# EAGLE schematic mainboard_rev_a (EAGLE 6.2)

## Sheet 1 of 4: MCU
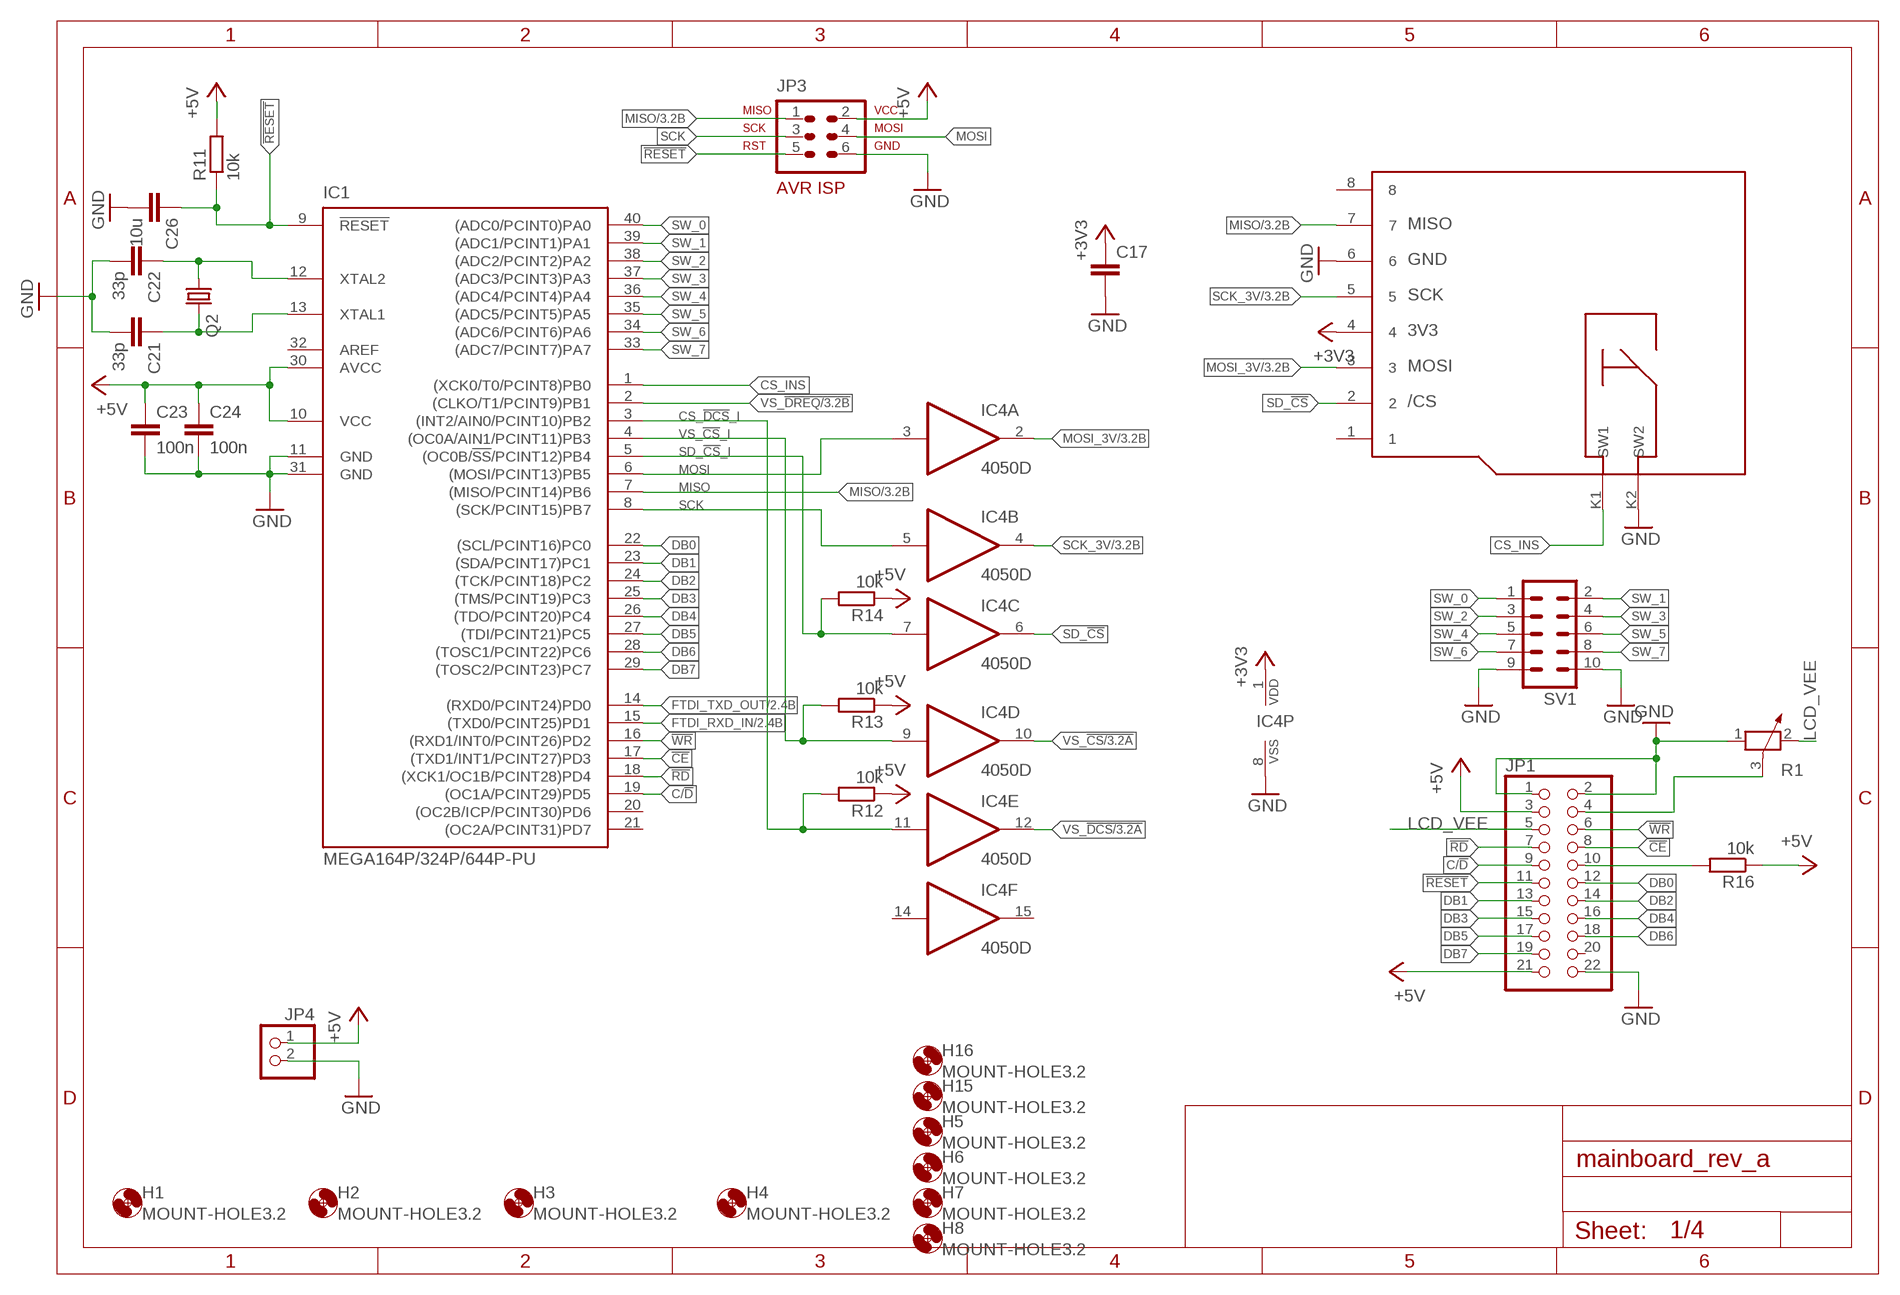
[diagram p0: schematic, sheet 1]

### Parts
C17  C-EUC1206  [C1206]
C21  33p  C-EUC0603  [C0603]
C22  33p  C-EUC0603  [C0603]
C23  100n  C-EUC0603  [C0603]
C24  100n  C-EUC0603  [C0603]
C26  10u  C-EUC1206  [C1206]
H1  MOUNT-HOLE3.2  [3,2]
H2  MOUNT-HOLE3.2  [3,2]
H3  MOUNT-HOLE3.2  [3,2]
H4  MOUNT-HOLE3.2  [3,2]
H5  MOUNT-HOLE3.2  [3,2]
H6  MOUNT-HOLE3.2  [3,2]
H7  MOUNT-HOLE3.2  [3,2]
H8  MOUNT-HOLE3.2  [3,2]
H15  MOUNT-HOLE3.2  [3,2]
H16  MOUNT-HOLE3.2  [3,2]
IC1  MEGA164P/324P/644P-PU  [DIL40]
IC4  4050D  [SO16]
JP1  PINHD-2X11  [2X11]
JP3  AVR-ISP-6VERT  [AVR-ISP-6]
JP4  PINHD-1X2  [1X02]
Q2  CRYSTALHC49UP  [HC49UP]
R1  POTENTIOMETER_PT_SPIN  [PT-SPIN]
R11  10k  R-EU_R0603  [R0603]
R12  10k  R-EU_R0603  [R0603]
R13  10k  R-EU_R0603  [R0603]
R14  10k  R-EU_R0603  [R0603]
R16  10k  R-EU_R0603  [R0603]
SV1  ML10  [ML10]
X2  MICRO-SD  [MICRO-SD]

### Nets
!CE: IC1.17((TXD1/INT1/PCINT27)PD3) JP1.8
!HALT: JP1.10 R16.2
!RD: IC1.18((XCK1/OC1B/PCINT28)PD4) JP1.7
!RESET: C26.1 IC1.9(!RESET) JP1.11 JP3.5 R11.1
!WR: IC1.16((RXD1/INT0/PCINT26)PD2) JP1.6
+3V3: C17.1 IC4.1(P:VDD) X2.4 ; also sheet 2,3
+5V: C23.1 C24.1 IC1.10(VCC) IC1.30(AVCC) JP1.3 JP1.21 JP3.2 JP4.1 R11.2 R12.1 R13.1 R14.1 R16.1 ; also sheet 2
C/!D: IC1.19((OC1A/PCINT29)PD5) JP1.9
CS_!DCS!_I: IC1.3((INT2/AIN0/PCINT10)PB2) IC4.11(E:I) R12.2
CS_INS: IC1.1((XCK0/T0/PCINT8)PB0) X2.K1(SW1)
DB0: IC1.22((SCL/PCINT16)PC0) JP1.12
DB1: IC1.23((SDA/PCINT17)PC1) JP1.13
DB2: IC1.24((TCK/PCINT18)PC2) JP1.14
DB3: IC1.25((TMS/PCINT19)PC3) JP1.15
DB4: IC1.26((TDO/PCINT20)PC4) JP1.16
DB5: IC1.27((TDI/PCINT21)PC5) JP1.17
DB6: IC1.28((TOSC1/PCINT22)PC6) JP1.18
DB7: IC1.29((TOSC2/PCINT23)PC7) JP1.19
FTDI_RXD_IN: IC1.15((TXD0/PCINT25)PD1) ; also sheet 2
FTDI_TXD_OUT: IC1.14((RXD0/PCINT24)PD0) ; also sheet 2
GND: C17.2 C21.2 C22.2 C23.2 C24.2 C26.2 IC1.11(GND) IC1.31(GND) IC4.8(P:VSS) JP1.1 JP1.2 JP1.22 JP3.6 JP4.2 R1.1 SV1.9 SV1.10 X2.6 X2.K2(SW2) ; also sheet 2,3,4
LCD_VEE: JP1.5 R1.2
MISO: IC1.7((MISO/PCINT14)PB6) JP3.1 X2.7 ; also sheet 3
MOSI: IC1.6((MOSI/PCINT13)PB5) IC4.3(A:I) JP3.4
MOSI_3V: IC4.2(A:O) X2.3 ; also sheet 3
N$1: JP1.4 R1.3
N$21: C21.1 IC1.13(XTAL1) Q2.2
N$22: C22.1 IC1.12(XTAL2) Q2.1
SCK: IC1.8((SCK/PCINT15)PB7) IC4.5(B:I) JP3.3
SCK_3V: IC4.4(B:O) X2.5 ; also sheet 3
SD_!CS: IC4.6(C:O) X2.2
SD_!CS!_I: IC1.5((OC0B/!SS!/PCINT12)PB4) IC4.7(C:I) R14.2
SW_0: IC1.40((ADC0/PCINT0)PA0) SV1.1
SW_1: IC1.39((ADC1/PCINT1)PA1) SV1.2
SW_2: IC1.38((ADC2/PCINT2)PA2) SV1.3
SW_3: IC1.37((ADC3/PCINT3)PA3) SV1.4
SW_4: IC1.36((ADC4/PCINT4)PA4) SV1.5
SW_5: IC1.35((ADC5/PCINT5)PA5) SV1.6
SW_6: IC1.34((ADC6/PCINT6)PA6) SV1.7
SW_7: IC1.33((ADC7/PCINT7)PA7) SV1.8
VS_!CS: IC4.10(D:O) ; also sheet 3
VS_!CS!_I: IC1.4((OC0A/AIN1/PCINT11)PB3) IC4.9(D:I) R13.2
VS_!DCS: IC4.12(E:O) ; also sheet 3
VS_!DREQ: IC1.2((CLKO/T1/PCINT9)PB1) ; also sheet 3
Unconnected: IC1.20((OC2B/ICP/PCINT30)PD6) IC1.21((OC2A/PCINT31)PD7) IC4.14(F:I) IC4.15(F:O) JP1.20 X2.1 X2.8

## Sheet 2 of 4: USB
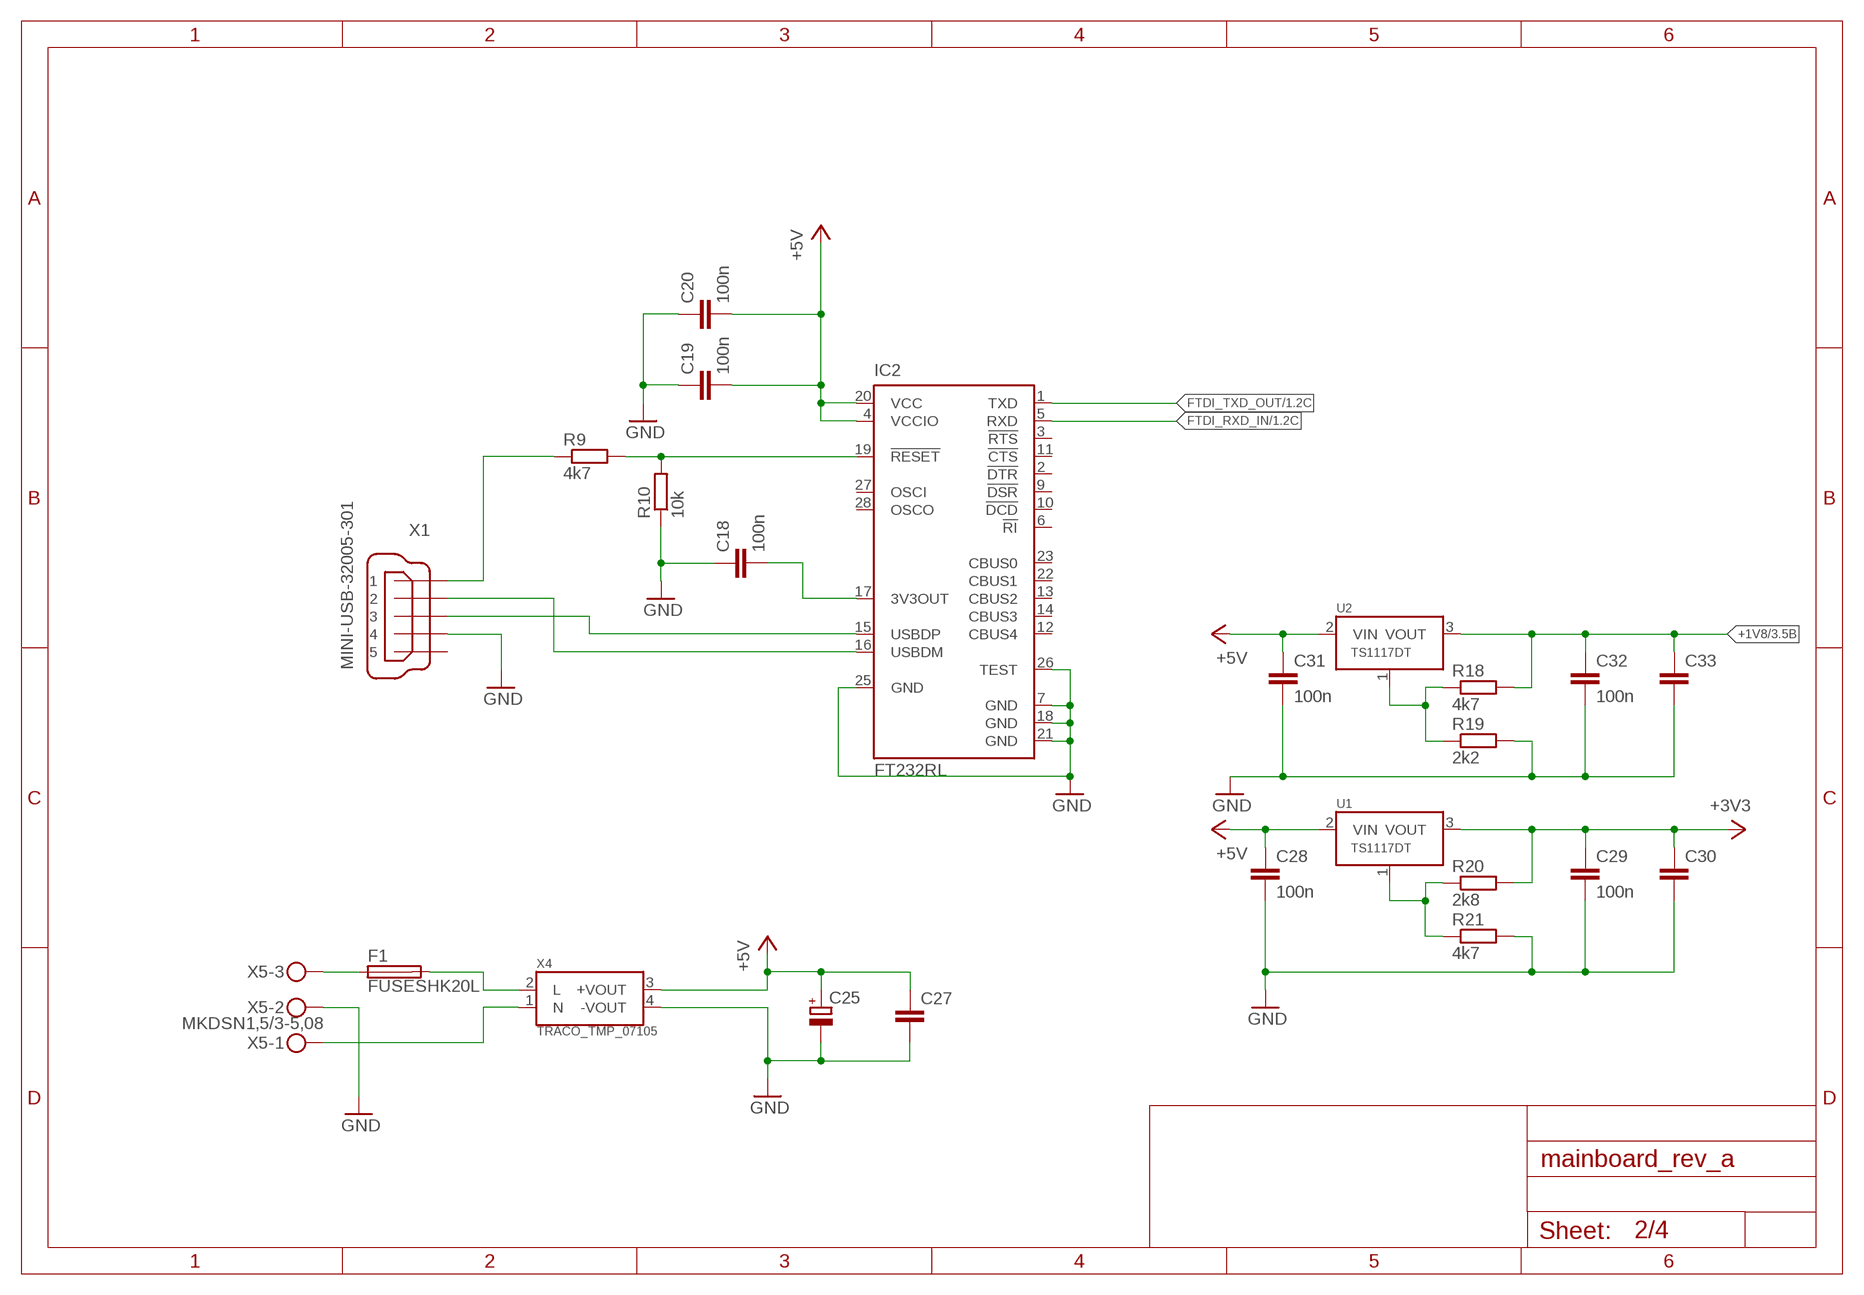
[diagram p1: schematic, sheet 2]

### Parts
C18  100n  C-EUC0603  [C0603]
C19  100n  C-EUC0603  [C0603]
C20  100n  C-EUC0603  [C0603]
C25  CPOL-EU153CLV-0807  [153CLV-0807]
C27  C-EUC1206  [C1206]
C28  100n  C-EUC0603  [C0603]
C29  100n  C-EUC0603  [C0603]
C30  C-EUC1206  [C1206]
C31  100n  C-EUC0603  [C0603]
C32  100n  C-EUC0603  [C0603]
C33  C-EUC1206  [C1206]
F1  FUSESHK20L  [SHK20L]
IC2  FT232RL  [SSOP28]
R9  4k7  R-EU_R0603  [R0603]
R10  10k  R-EU_R0603  [R0603]
R18  4k7  R-EU_R0603  [R0603]
R19  2k2  R-EU_R0603  [R0603]
R20  2k8  R-EU_R0603  [R0603]
R21  4k7  R-EU_R0603  [R0603]
U1  TS1117DT  [TO252]
U2  TS1117DT  [TO252]
X1  MINI-USB-32005-301  [32005-301]
X4  TRACO_TMP_07105  [TRACO_TMP_07]
X5  MKDSN1,5/3-5,08  [MKDSN1,5/3-5,08]

### Nets
+1V8: C32.1 C33.1 R18.2 U2.3(VOUT) ; also sheet 3
+3V3: C29.1 C30.1 R20.2 U1.3(VOUT) ; also sheet 1,3
+5V: C19.2 C20.2 C25.+ C27.1 C28.1 C31.1 IC2.4(VCCIO) IC2.20(VCC) U1.2(VIN) U2.2(VIN) X4.3(+VOUT) ; also sheet 1
FTDI_RXD_IN: IC2.5(RXD) ; also sheet 1
FTDI_TXD_OUT: IC2.1(TXD) ; also sheet 1
GND: C18.1 C19.1 C20.1 C25.- C27.2 C28.2 C29.2 C30.2 C31.2 C32.2 C33.2 IC2.7(GND) IC2.18(GND) IC2.21(GND) IC2.25(GND) IC2.26(TEST) R10.1 R19.2 R21.2 X1.4 X4.4(-VOUT) X5.2 ; also sheet 1,3,4
N$5: F1.1A X5.3
N$12: F1.2A X4.2(L)
N$16: C18.2 IC2.17(3V3OUT)
N$17: IC2.16(USBDM) X1.2
N$18: IC2.15(USBDP) X1.3
N$19: R9.1 X1.1
N$20: IC2.19(!RESET) R9.2 R10.2
N$23: X4.1(N) X5.1
N$25: R20.1 R21.1 U1.1(ADJ)
N$26: R18.1 R19.1 U2.1(ADJ)
Unconnected: IC2.2(!DTR) IC2.3(!RTS) IC2.6(!RI) IC2.9(!DSR) IC2.10(!DCD) IC2.11(!CTS) IC2.12(CBUS4) IC2.13(CBUS2) IC2.14(CBUS3) IC2.22(CBUS1) IC2.23(CBUS0) IC2.27(OSCI) IC2.28(OSCO) X1.5

## Sheet 3 of 4: MP3
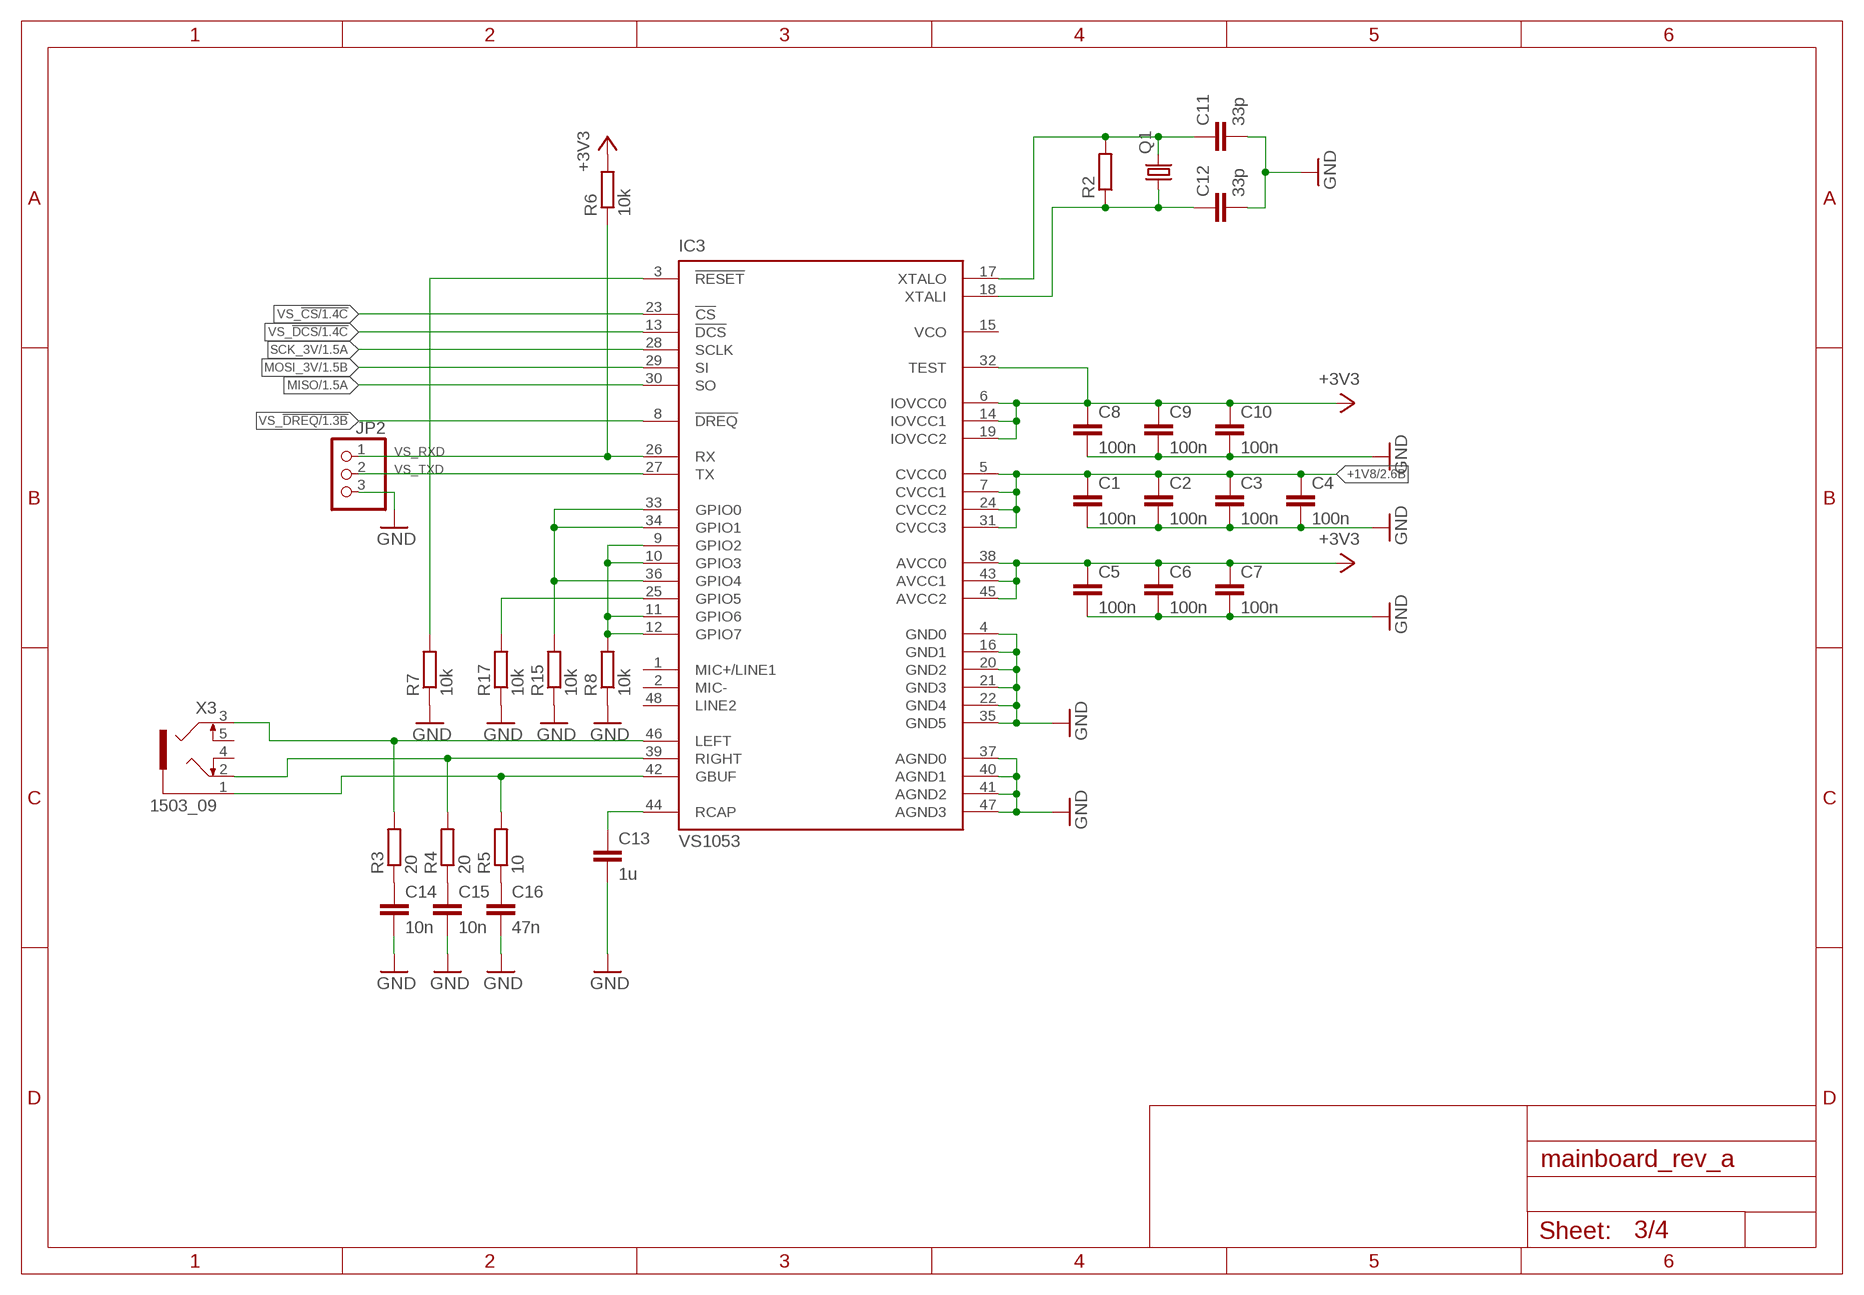
[diagram p2: schematic, sheet 3]

### Parts
C1  100n  C-EUC0603  [C0603]
C2  100n  C-EUC0603  [C0603]
C3  100n  C-EUC0603  [C0603]
C4  100n  C-EUC0603  [C0603]
C5  100n  C-EUC0603  [C0603]
C6  100n  C-EUC0603  [C0603]
C7  100n  C-EUC0603  [C0603]
C8  100n  C-EUC0603  [C0603]
C9  100n  C-EUC0603  [C0603]
C10  100n  C-EUC0603  [C0603]
C11  33p  C-EUC0603  [C0603]
C12  33p  C-EUC0603  [C0603]
C13  1u  C-EUC0805  [C0805]
C14  10n  C-EUC0603  [C0603]
C15  10n  C-EUC0603  [C0603]
C16  47n  C-EUC0603  [C0603]
IC3  VS1053  [LQFP-48]
JP2  PINHD-1X3  [1X03]
Q1  CRYSTALHC49UP  [HC49UP]
R2  R-EU_R0603  [R0603]
R3  20  R-EU_R0603  [R0603]
R4  20  R-EU_R0603  [R0603]
R5  10  R-EU_R0603  [R0603]
R6  10k  R-EU_R0603  [R0603]
R7  10k  R-EU_R0603  [R0603]
R8  10k  R-EU_R0603  [R0603]
R15  10k  R-EU_R0603  [R0603]
R17  10k  R-EU_R0603  [R0603]
X3  1503_09  [1503_09]

### Nets
+1V8: C1.1 C2.1 C3.1 C4.1 IC3.5(CVCC0) IC3.7(CVCC1) IC3.24(CVCC2) IC3.31(CVCC3) ; also sheet 2
+3V3: C5.1 C6.1 C7.1 C8.1 C9.1 C10.1 IC3.6(IOVCC0) IC3.14(IOVCC1) IC3.19(IOVCC2) IC3.32(TEST) IC3.38(AVCC0) IC3.43(AVCC1) IC3.45(AVCC2) R6.2 ; also sheet 1,2
GBUF: IC3.42(GBUF) R5.2 X3.1
GND: C1.2 C2.2 C3.2 C4.2 C5.2 C6.2 C7.2 C8.2 C9.2 C10.2 C11.2 C12.2 C13.2 C14.2 C15.2 C16.2 IC3.4(GND0) IC3.16(GND1) IC3.20(GND2) IC3.21(GND3) IC3.22(GND4) IC3.35(GND5) IC3.37(AGND0) IC3.40(AGND1) IC3.41(AGND2) IC3.47(AGND3) JP2.3 R7.1 R8.1 R15.1 R17.1 ; also sheet 1,2,4
LEFT: IC3.46(LEFT) R3.2 X3.3
MISO: IC3.30(SO) ; also sheet 1
MOSI_3V: IC3.29(SI) ; also sheet 1
N$2: C13.1 IC3.44(RCAP)
N$3: IC3.9(GPIO2) IC3.10(GPIO3) IC3.11(GPIO6) IC3.12(GPIO7) R8.2
N$4: IC3.33(GPIO0) IC3.34(GPIO1) IC3.36(GPIO4) R15.2
N$6: C14.1 R3.1
N$7: C15.1 R4.1
N$8: C11.1 IC3.17(XTALO) Q1.2 R2.2
N$9: C16.1 R5.1
N$10: C12.1 IC3.18(XTALI) Q1.1 R2.1
N$11: IC3.3(!RESET) R7.2
N$24: IC3.25(GPIO5) R17.2
RIGHT: IC3.39(RIGHT) R4.2 X3.2
SCK_3V: IC3.28(SCLK) ; also sheet 1
VS_!CS: IC3.23(!CS) ; also sheet 1
VS_!DCS: IC3.13(!DCS) ; also sheet 1
VS_!DREQ: IC3.8(!DREQ) ; also sheet 1
VS_RXD: IC3.26(RX) JP2.1 R6.1
VS_TXD: IC3.27(TX) JP2.2
Unconnected: IC3.1(MIC+/LINE1) IC3.2(MIC-) IC3.15(VCO) IC3.48(LINE2) X3.4 X3.5

## Sheet 4 of 4: Buttons
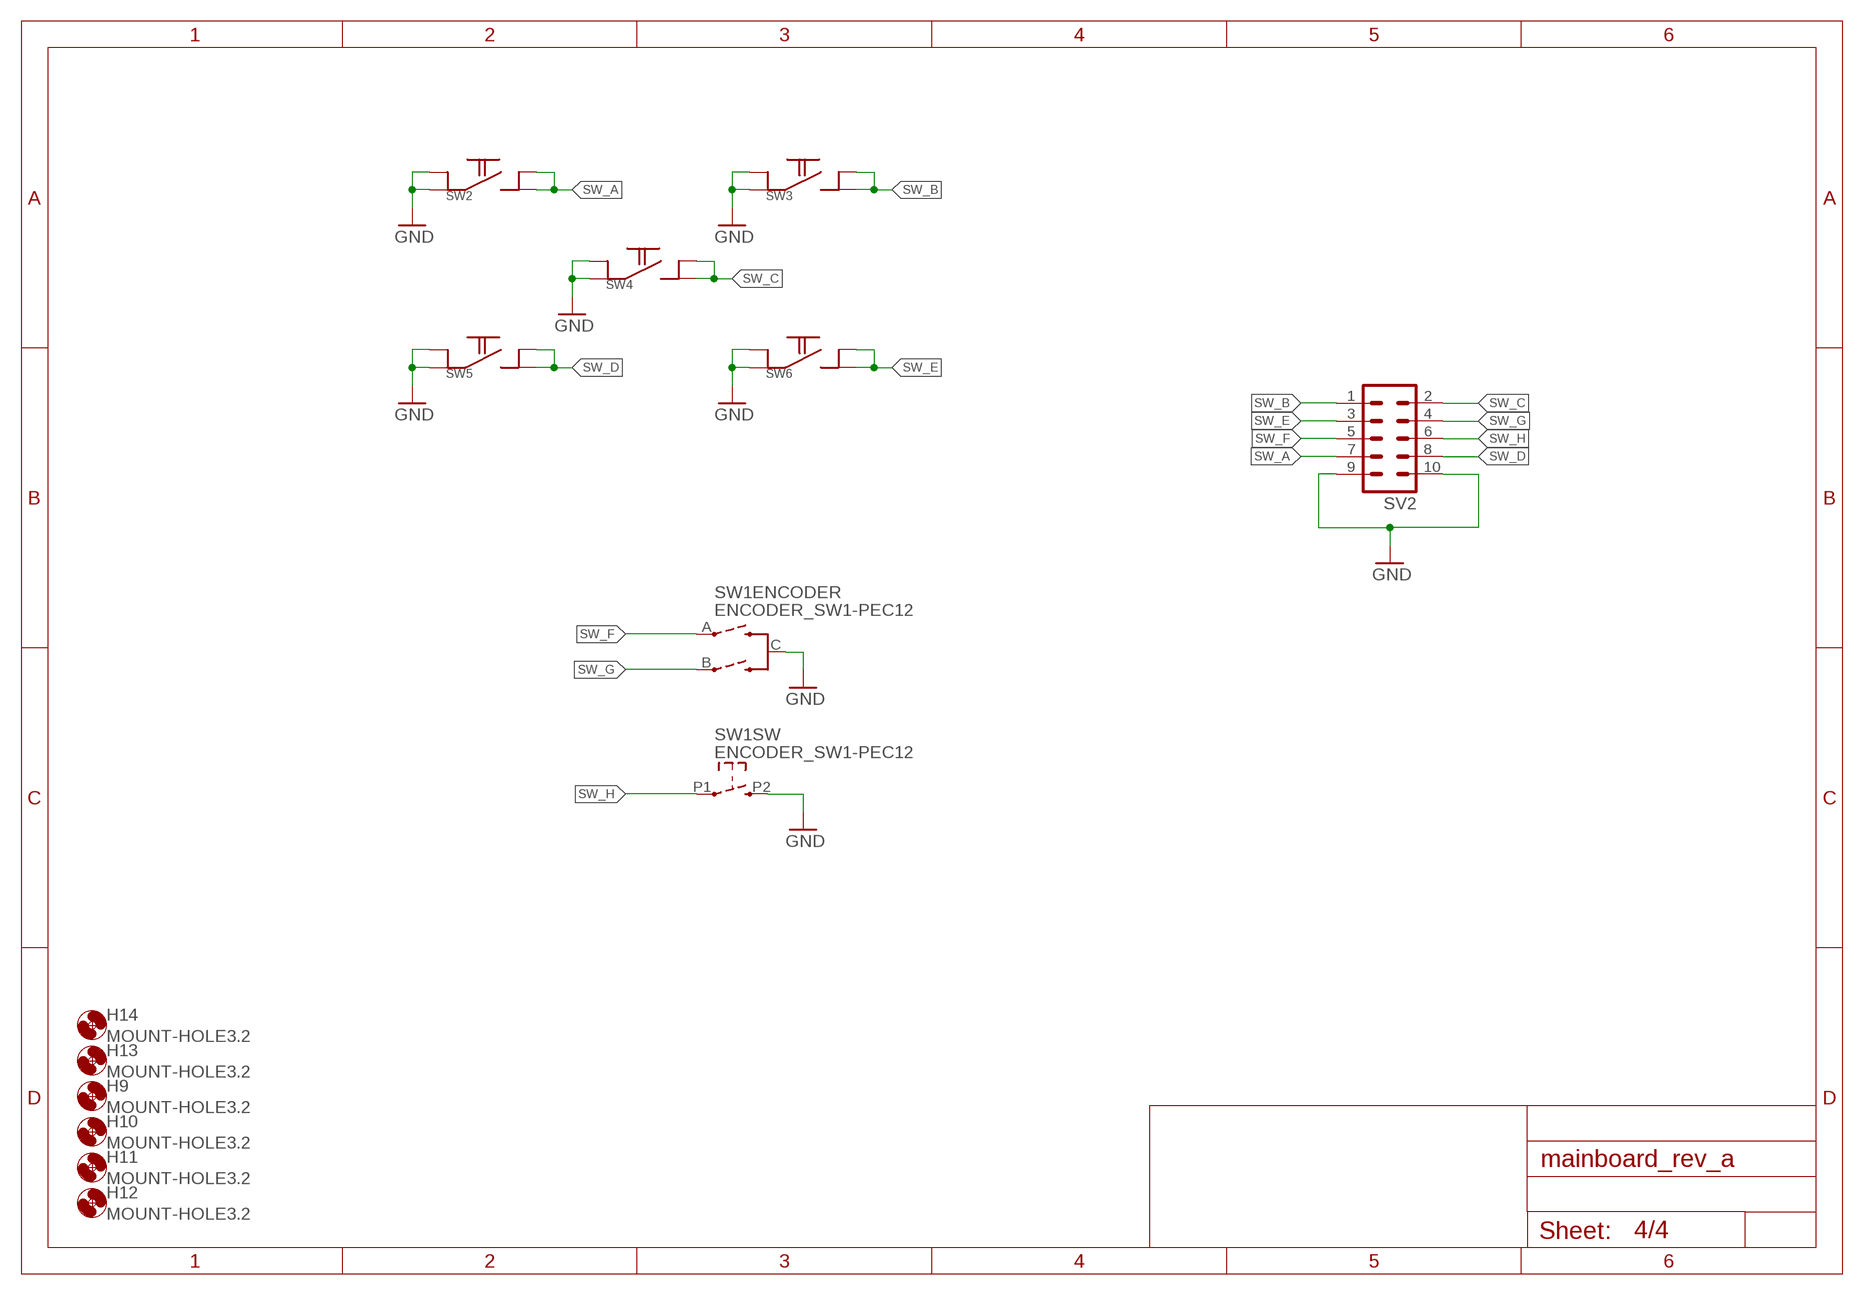
[diagram p3: schematic, sheet 4]

### Parts
H9  MOUNT-HOLE3.2  [3,2]
H10  MOUNT-HOLE3.2  [3,2]
H11  MOUNT-HOLE3.2  [3,2]
H12  MOUNT-HOLE3.2  [3,2]
H13  MOUNT-HOLE3.2  [3,2]
H14  MOUNT-HOLE3.2  [3,2]
SV2  ML10  [ML10]
SW1  ENCODER_SW1-PEC12  [PEC12_INCREMENTAL_ENCODER]
SW2  PUSHBUTTON_12X12  [PUSHBUTTON_12X12]
SW3  PUSHBUTTON_12X12  [PUSHBUTTON_12X12]
SW4  PUSHBUTTON_12X12  [PUSHBUTTON_12X12]
SW5  PUSHBUTTON_12X12  [PUSHBUTTON_12X12]
SW6  PUSHBUTTON_12X12  [PUSHBUTTON_12X12]

### Nets
GND: SV2.9 SV2.10 SW1.C(ENCODER:C) SW1.P2 SW2.A@1(A) SW2.A@2(A) SW3.A@1(A) SW3.A@2(A) SW4.A@1(A) SW4.A@2(A) SW5.A@1(A) SW5.A@2(A) SW6.A@1(A) SW6.A@2(A) ; also sheet 1,2,3
SW_A: SV2.7 SW2.B@1(B) SW2.B@2(B)
SW_B: SV2.1 SW3.B@1(B) SW3.B@2(B)
SW_C: SV2.2 SW4.B@1(B) SW4.B@2(B)
SW_D: SV2.8 SW5.B@1(B) SW5.B@2(B)
SW_E: SV2.3 SW6.B@1(B) SW6.B@2(B)
SW_F: SV2.5 SW1.A(ENCODER:A)
SW_G: SV2.4 SW1.B(ENCODER:B)
SW_H: SV2.6 SW1.P1

## Power pins joined to a net without a drawn wire
AREF: IC1.32(AREF)

## Library data of the parts
C1-C24 C26-C33 = rcl:C-EU: CAPACITOR, European symbol
C25 = rcl:CPOL-EU: POLARIZED CAPACITOR, European symbol
F1 = fuse:FUSE: Fuse; OC_FARNELL: unknown; OC_NEWARK: unknown
H1-H16 = holes:MOUNT-HOLE: MOUNTING HOLE with drill center marker
IC1 = avr-7:MEGA164P/324P/644P-PU
IC2 = ftdichip:FT232R: Source: http://www.ftdichip.com/Documents/DataSheets/DS_FT232R_v104.pdf; MPN: FT232RL; OC_FARNELL: 1146032; OC_NEWARK: 91K9918
IC3 = welectronic:VS1053
IC4 = 40xx:4050: Hex non-inverting BUFFER
JP1 = pinhead:PINHD-2X11: PIN HEADER
JP2 = pinhead:PINHD-1X3: PIN HEADER
JP3 = avr-7:AVR-ISP-6: AVR ISP-6 Serial Programming Header
JP4 = pinhead:PINHD-1X2: PIN HEADER
Q1 Q2 = crystal:CRYSTAL: CRYSTAL; OC_FARNELL: unknown; OC_NEWARK: unknown
R1 = rcl:POTENTIOMETER_: Potentiometer
R2-R21 = rcl:R-EU_: RESISTOR, European symbol
SV1 SV2 = con-harting-ml:ML10: HARTING; OC_FARNELL: unknown; OC_NEWARK: unknown
SW1 = dp_devices:ENCODER_SW1: Incremental Encoder with push switch
SW2-SW6 = sebastian:PUSHBUTTON
U1 U2 = sebastian:TS1117
X1 = con-cypressindustries:MINI-USB-: MINI USB-B Conector Source: www.cypressindustries.com; OC_FARNELL: unknown; OC_NEWARK: unknown
X2 = welectronic:MICRO-SD
X3 = con-lumberg:1503_09: Jack connectors according to JISC 6560, 3.5 mm Klinkeneinbaukupplung nach JISC 6560, 3,5 mm, 3-polig/ stereo, abgewinkelte Ausführung, mit 2 Öffnern und Lötaugen, für Leiterplatten Rückseitenmontage Source: http://www.lumberg.com/Produkte/PDFs/1503_09.pdf; OC_FARNELL: 1243244; OC_NEWARK: unknown
X4 = sebastian:TRACO_TMP_07; MF: TracoPower; MPN: TMP 07105; OC_FARNELL: 1672132
X5 = con-phoenix-508:MKDSN1,5/3-5,08: MKDSN 1,5/ 3-5,08 Printklemme Nennstrom: 13,5 A Nennspannung: 250 V Rastermaß: 5,08 mm Polzahl: 3 Anschlussart: Schraubanschluss Montage: Löten Anschlussrichtung Leiter/Platine: 0 ° Artikelnummer: 1729131 Source: http://eshop.phoenixcontact.com .. 1729131.pdf; MPN: SMKDSN1,5/3-5,08; OC_FARNELL: 1792904; OC_NEWARK: 70R0299